# EasyEDA Pro project ProPrj_USB Hub Port PCB_2026-05-30.epro

# Schematic Schematic1
Board Name: Board1; Create Date: 2026-04-19; Page Name: P1; Project Name: USB Hub Port PCB; Schematic Name: Schematic1; Update Date: 2026-04-21; Company: EasyEDA.com; Page Size: A4; Version: V1.0
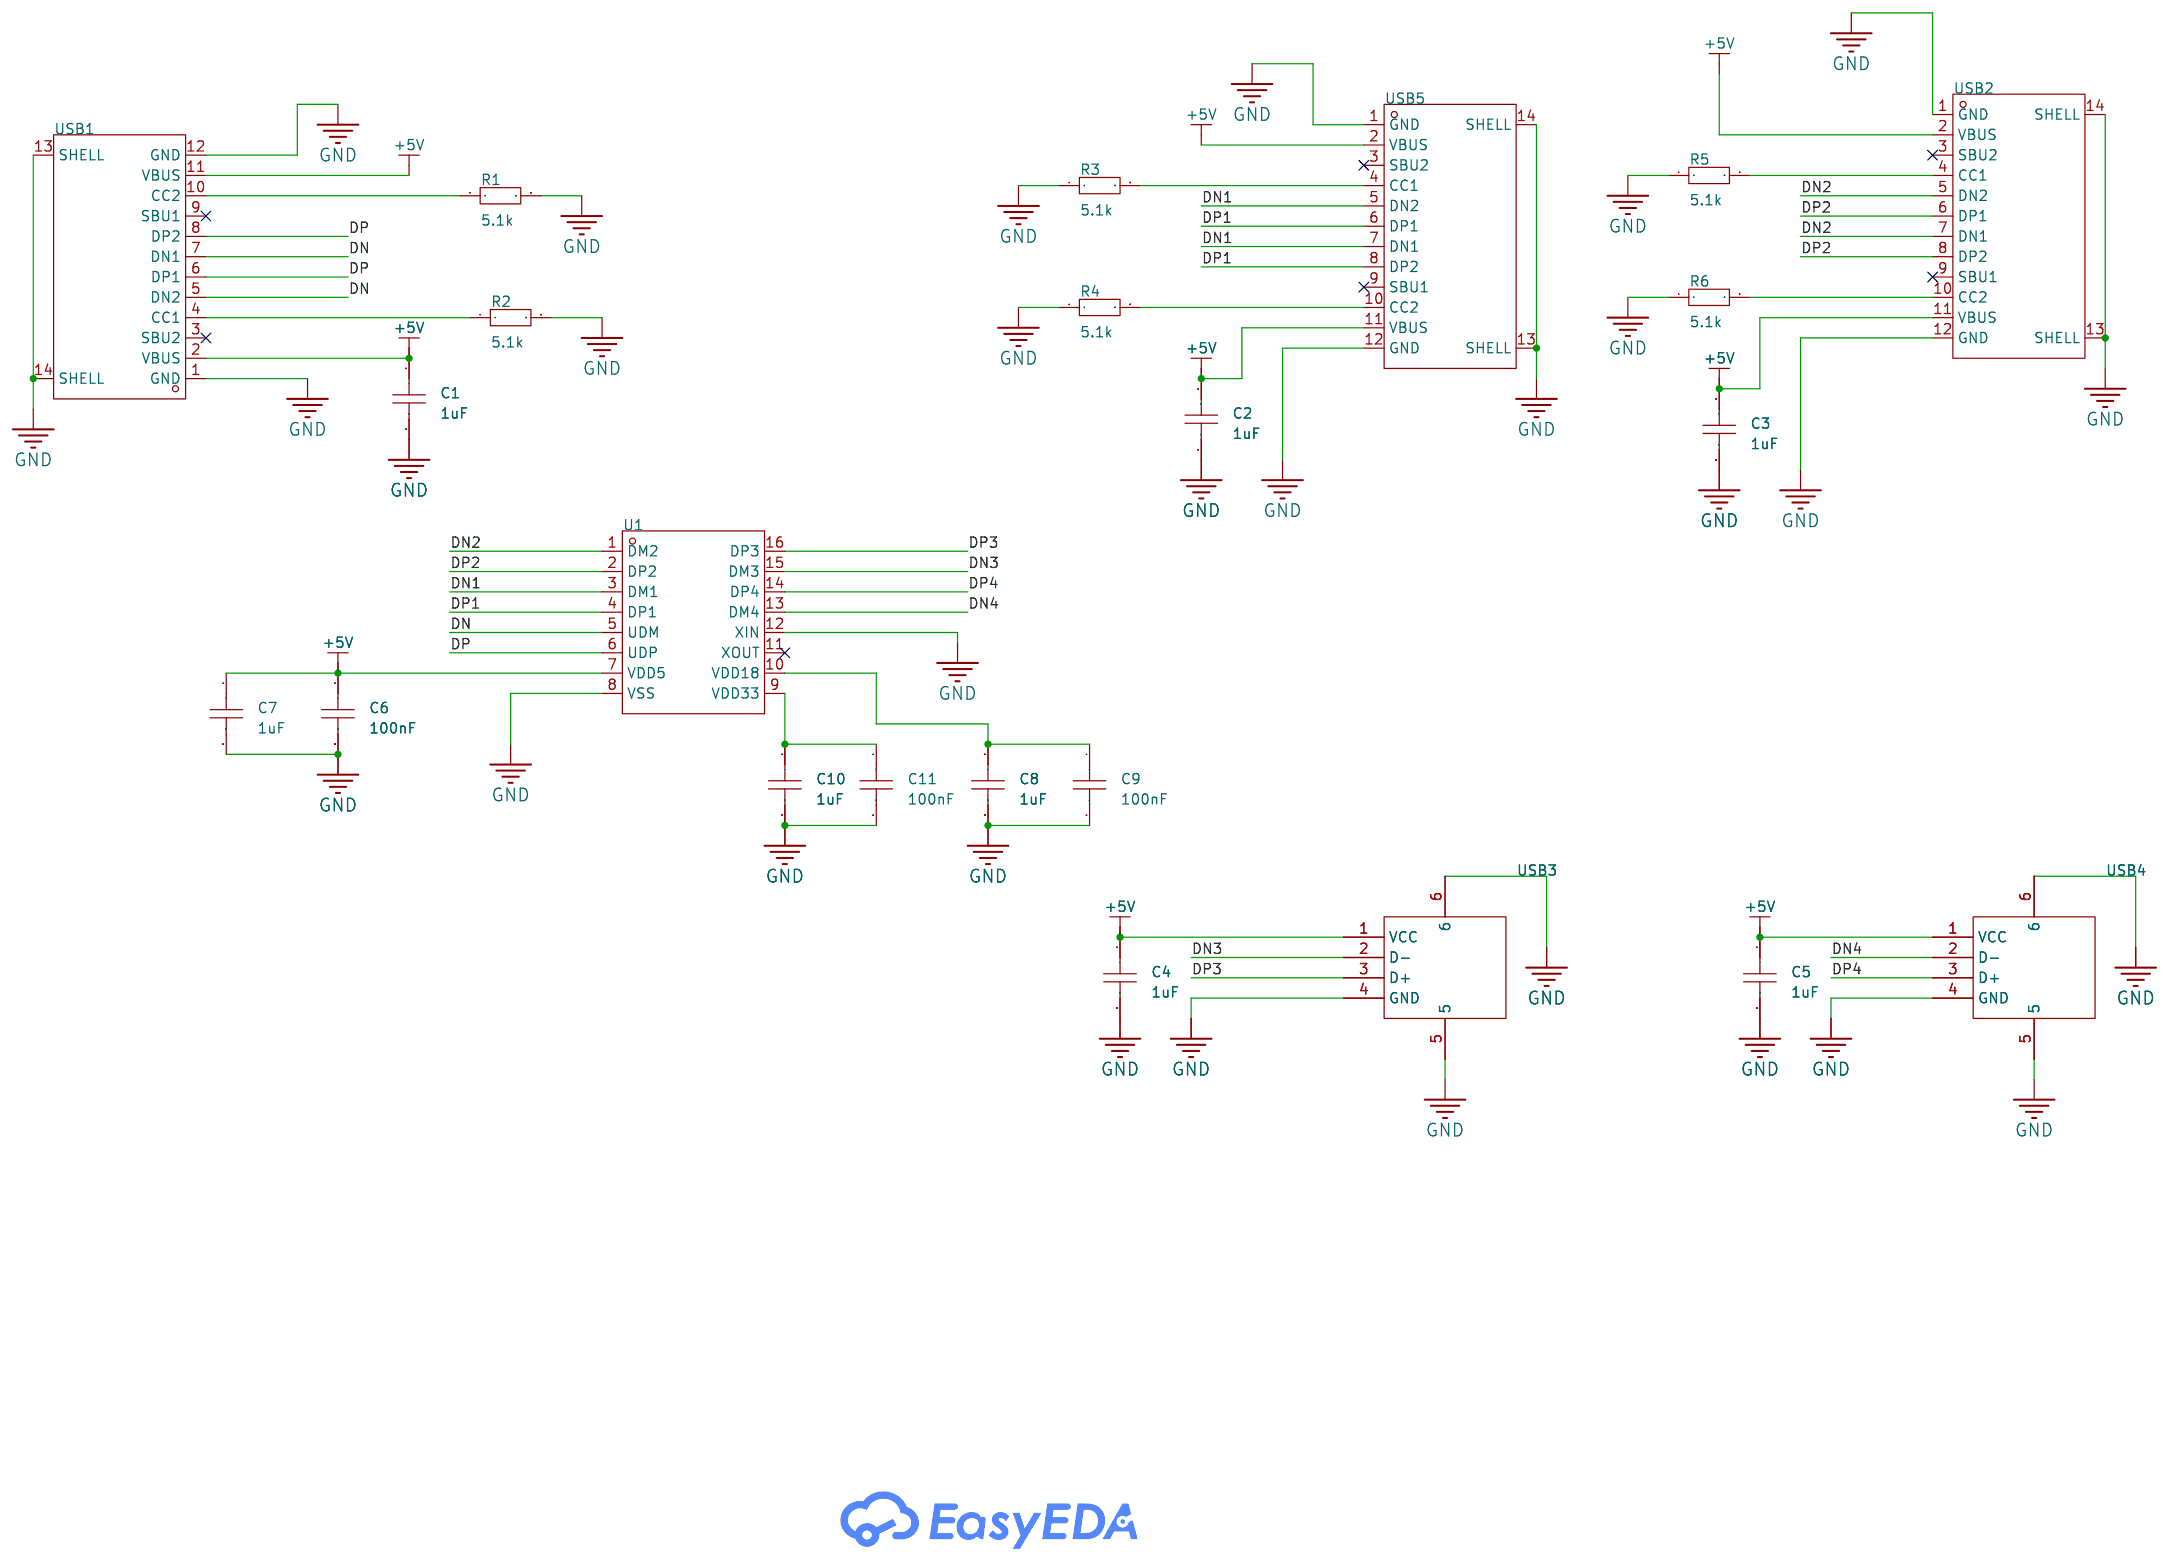
[diagram p0: schematic sheet]

## Parts
C1  1uF  [C0603]
C2  1uF  [C0603]
C3  1uF  [C0603]
C4  1uF  [C0603]
C5  1uF  [C0603]
C6  100nF  [C0603]
C7  1uF  [C0603]
C8  1uF  [C0603]
C9  100nF  [C0603]
C10  1uF  [C0603]
C11  100nF  [C0603]
R1  5.1k  [R0603]
R2  5.1k  [R0603]
R3  5.1k  [R0603]
R4  5.1k  [R0603]
R5  5.1k  [R0603]
R6  5.1k  [R0603]
U1  SL2.1s  [SSOP-16_L4.6-W2.6-P0.53-LS4.0-BL]
USB1  TYPE-C 16PIN 2MD(073)  [USB-C-SMD_TYPE-C-6PIN-2MD-073]
USB2  TYPE-C 16PIN 2MD(073)  [USB-C-SMD_TYPE-C-6PIN-2MD-073]
USB3  10.0 QHHTZB6.3  [USB-A-TH_10.0QHHTZB6.3]
USB4  10.0 QHHTZB6.3  [USB-A-TH_10.0QHHTZB6.3]
USB5  TYPE-C 16PIN 2MD(073)  [USB-C-SMD_TYPE-C-6PIN-2MD-073]

## Library data of the parts
C1-C11 = CAP_0603: Supplier Footprint: 0603
R1-R6 = Res_0603: Supplier Footprint: 0603
U1 = SL2.1s: type:Hub USB Protocol:USB 2.0 Data Rate:- Voltage - Supply:4V~5.25V Voltage - Supply:4V~5.25V Operating Temperature:0℃~+70℃ Operating Temperature:0℃~+70℃ Memory Interface:- Current - Supply:120mA Quiescent Supply Current:2.5mA Number of Channels:4; LCSC Part Name: USB2.0 HUB控制器集成电路; Supplier Part: C2684433; Manufacturer: CoreChips(和芯润德); Supplier Footprint: SSOP-16; JLCPCB Part Class: Extended Part; Datasheet: https://item.szlcsc.com/datasheet/SL2.1s/2782346.html; Supplier: LCSC; type: Hub; USB Protocol: USB 2.0; Voltage - Supply: 4V~5.25V; Operating Temperature: 0℃~+70℃; Current - Supply: 120mA; Quiescent Supply Current: 2.5mA; Number of Channels: 4
USB1 USB2 USB5 = TYPE-C 16PIN 2MD(073): Connector Type:Type-C Protocol Standard:- Gender:Female Mounting Type:Surface Mount, Right Angle Number of Contacts:16P Number of Ports:1 Current Rating-Power:3A Voltage Rating:5V Connect-Disconnect Life:10,000 Cycles Supplementary Features:- Center Heigh; LCSC Part Name: Type-C 母 卧贴; Supplier Part: C2765186; Manufacturer: SHOU HAN(首韩); Supplier Footprint: SMD; JLCPCB Part Class: Extended Part; Datasheet: https://item.szlcsc.com/datasheet/TYPE-C%252016PIN%25202MD(073)/2901843.html; Supplier: LCSC; Connector Type: Type-C; Gender: Female; Mounting Type: Surface Mount, Right Angle; Number of Contacts: 16P; Number of Ports: 1; Current Rating-Power: 3A; Voltage Rating: 5V; Connect-Disconnect Life: 10,000 Cycles; Detection color: Black; Operating Temperature: -25℃~+85℃
USB3 USB4 = 10.0 QHHTZB6.3: Connector Type:Type-A Protocol Standard:USB 2.0 Gender:Female Mounting Type:Surface Mount, Right Angle Number of Contacts:4P Number of Ports:1 Current Rating-Power:1.5A Voltage Rating:30V Connect-Disconnect Life:5,000 times Supplementary Features:- Center; LCSC Part Name: 壳长10.0mm; Supplier Part: C668591; Manufacturer: SHOU HAN(首韩); Supplier Footprint: SMD; JLCPCB Part Class: Extended Part; Datasheet: https://item.szlcsc.com/datasheet/10.0%2520QHHTZB6.3/698534.html; Supplier: LCSC; Connector Type: Type-A; Protocol Standard: USB 2.0; Gender: Female; Mounting Type: Surface Mount, Right Angle; Number of Contacts: 4P; Number of Ports: 1; Current Rating-Power: 1.5A; Voltage Rating: 30V; Connect-Disconnect Life: 5,000 times; Length: 10mm; Detection color: Black; Operating Temperature: -25℃~+85℃

## Nets
+5V: C1.1 C2.1 C3.1 C4.1 C5.1 C6.1 C7.1 U1.7(VDD5) USB1.2(VBUS) USB1.11(VBUS) USB2.2(VBUS) USB2.11(VBUS) USB3.1(VCC) USB4.1(VCC) USB5.2(VBUS) USB5.11(VBUS)
GND: C1.2 C2.2 C3.2 C4.2 C5.2 C6.2 C7.2 C8.2 C9.2 C10.2 C11.2 R1.2 R2.2 R3.1 R4.1 R5.1 R6.1 U1.8(VSS) U1.12(XIN) USB1.1(GND) USB1.12(GND) USB1.13(SHELL) USB1.14(SHELL) USB2.1(GND) USB2.12(GND) USB2.13(SHELL) USB2.14(SHELL) USB3.4(GND) USB3.5 USB3.6 USB4.4(GND) USB4.5 USB4.6 USB5.1(GND) USB5.12(GND) USB5.13(SHELL) USB5.14(SHELL)
DN: U1.5(UDM) USB1.5(DN2) USB1.7(DN1)
DN1: U1.3(DM1) USB5.5(DN2) USB5.7(DN1)
DN2: U1.1(DM2) USB2.5(DN2) USB2.7(DN1)
DN3: U1.15(DM3) USB3.2(D-)
DN4: U1.13(DM4) USB4.2(D-)
DP: U1.6(UDP) USB1.6(DP1) USB1.8(DP2)
DP1: U1.4(DP1) USB5.6(DP1) USB5.8(DP2)
DP2: U1.2(DP2) USB2.6(DP1) USB2.8(DP2)
DP3: U1.16(DP3) USB3.3(D+)
DP4: U1.14(DP4) USB4.3(D+)
$1N1031: R1.1 USB1.10(CC2)
$1N1035: R2.1 USB1.4(CC1)
$1N1639: R3.2 USB5.4(CC1)
$1N1643: R4.2 USB5.10(CC2)
$1N2417: R6.2 USB2.10(CC2)
$1N2458: R5.2 USB2.4(CC1)
$1N2907: C8.1 C9.1 U1.10(VDD18)
$1N3014: C10.1 C11.1 U1.9(VDD33)

Not connected (* = marked no-connect by the designer): U1 11(XOUT)*; USB1 3(SBU2)* 9(SBU1)*; USB2 3(SBU2)* 9(SBU1)*; USB5 3(SBU2)* 9(SBU1)*

# Board PCB1
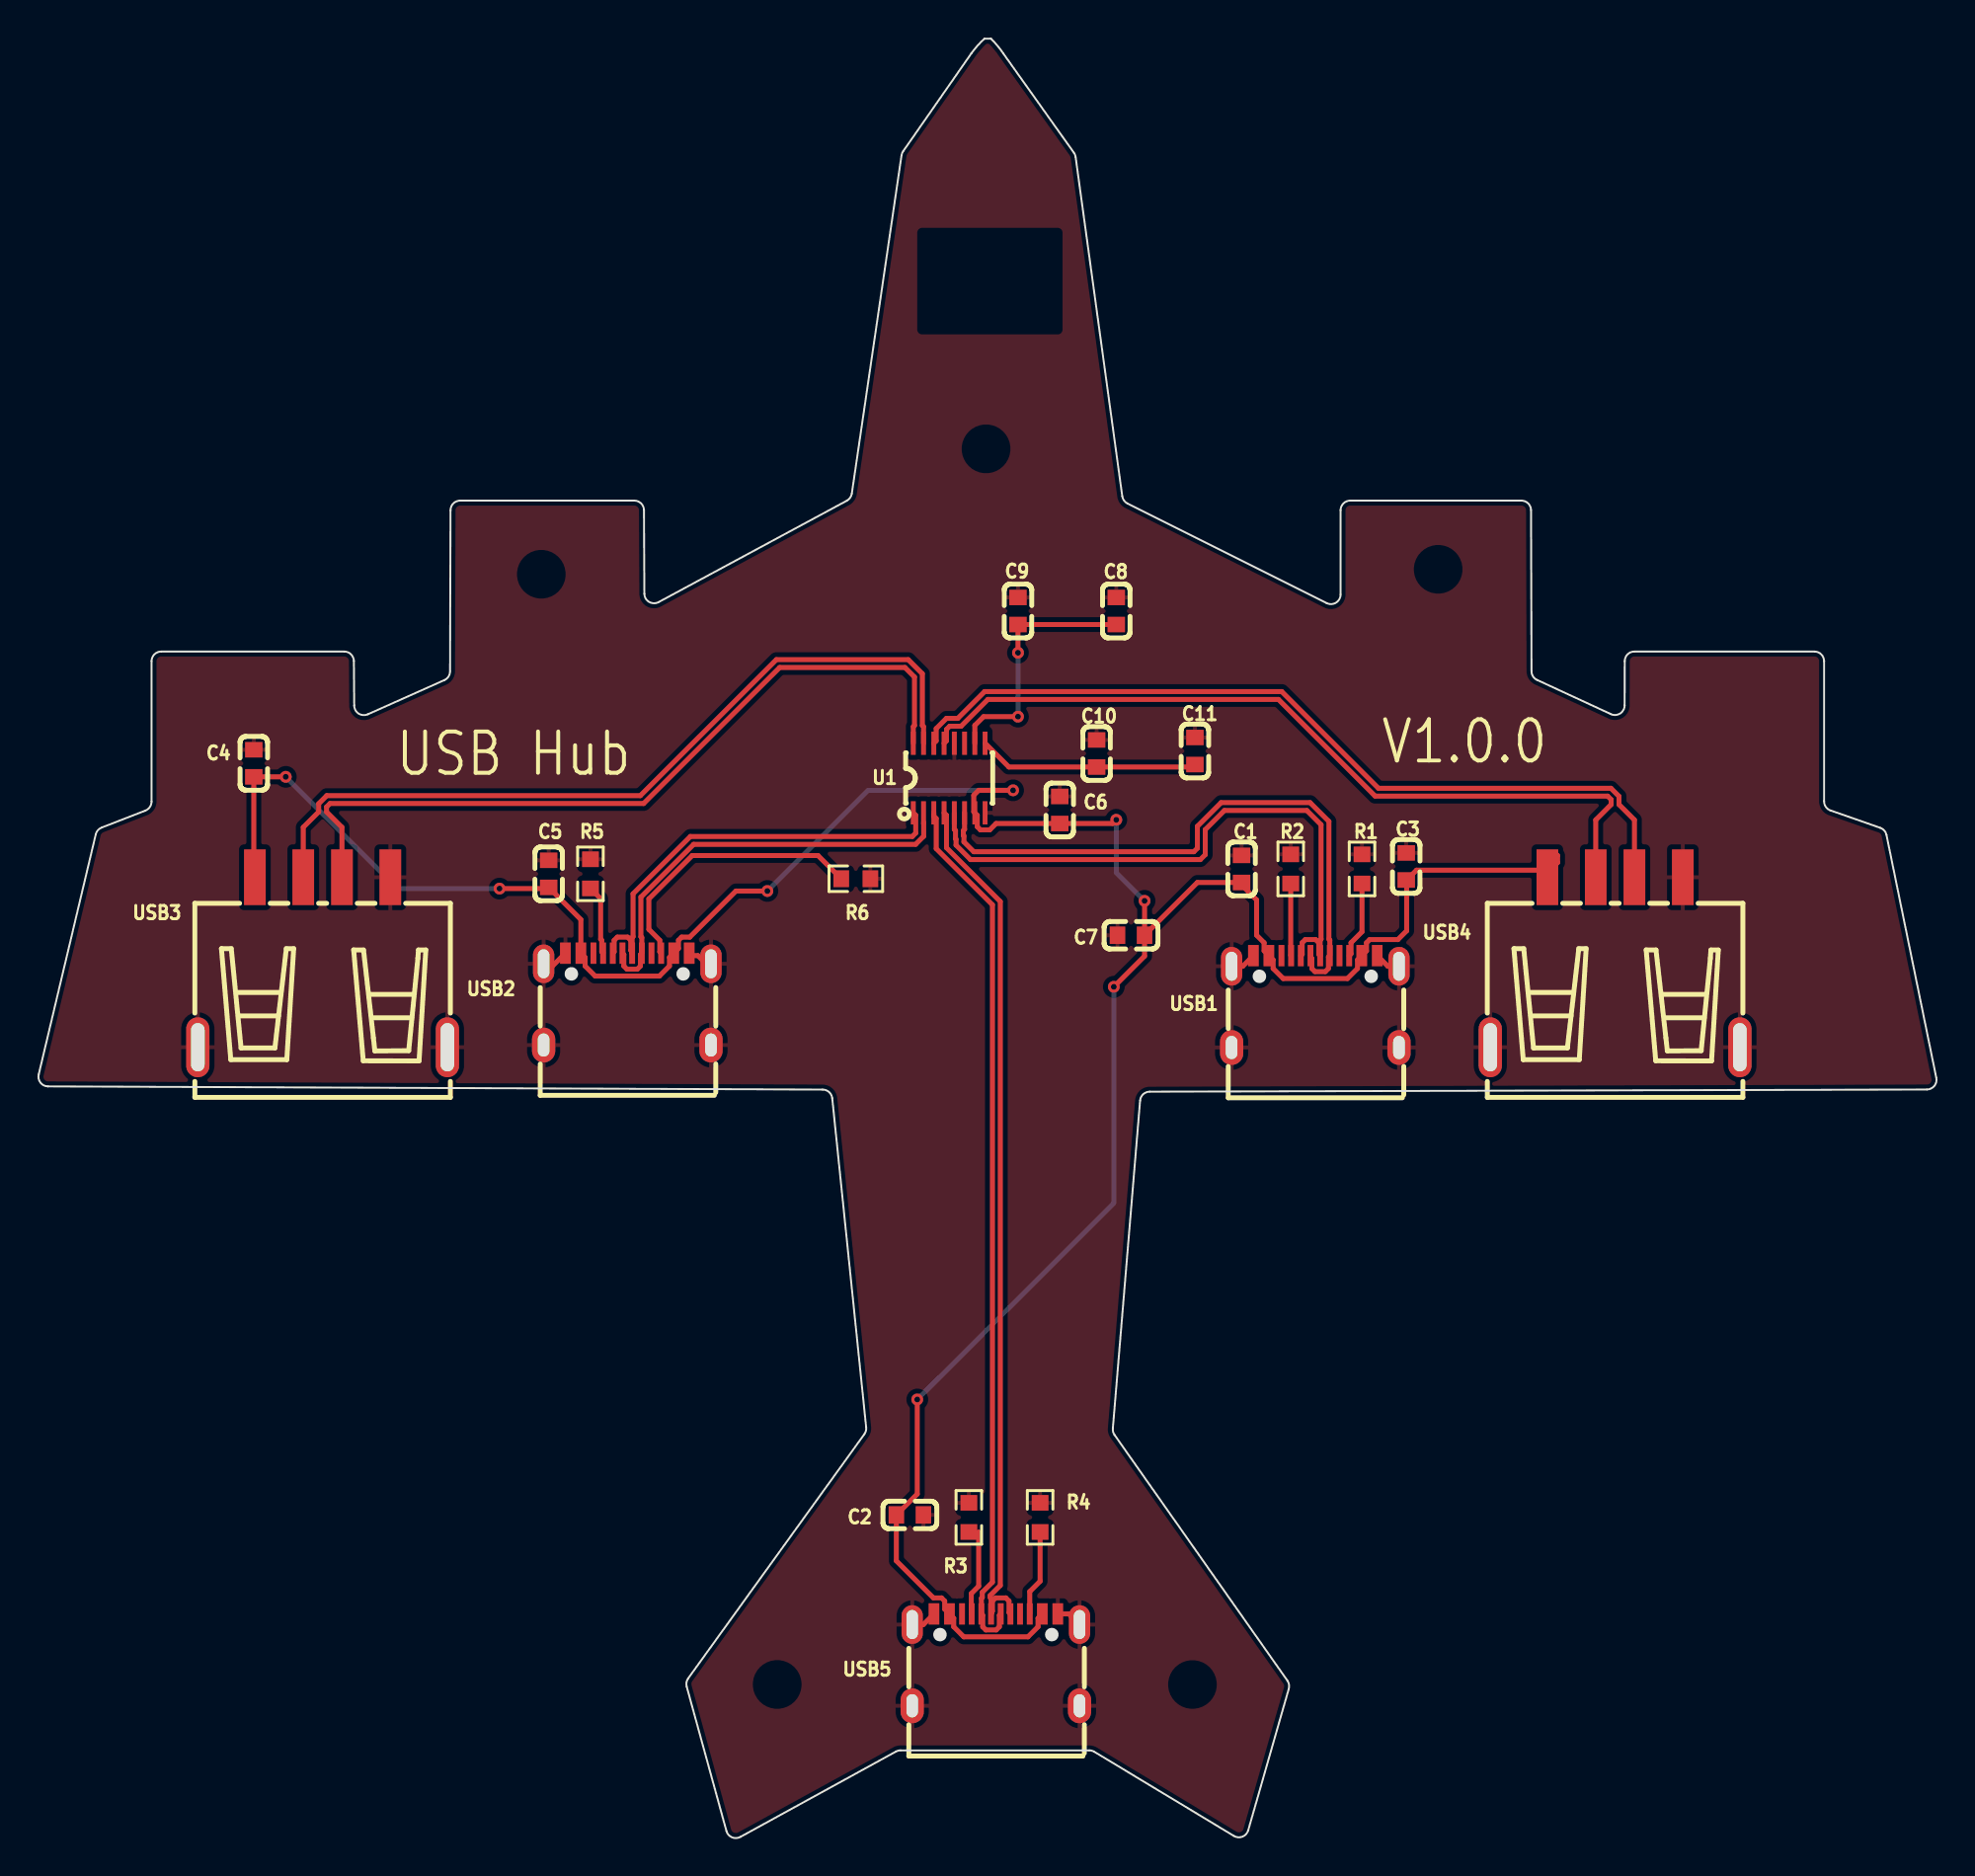
[diagram p1: board, top side]
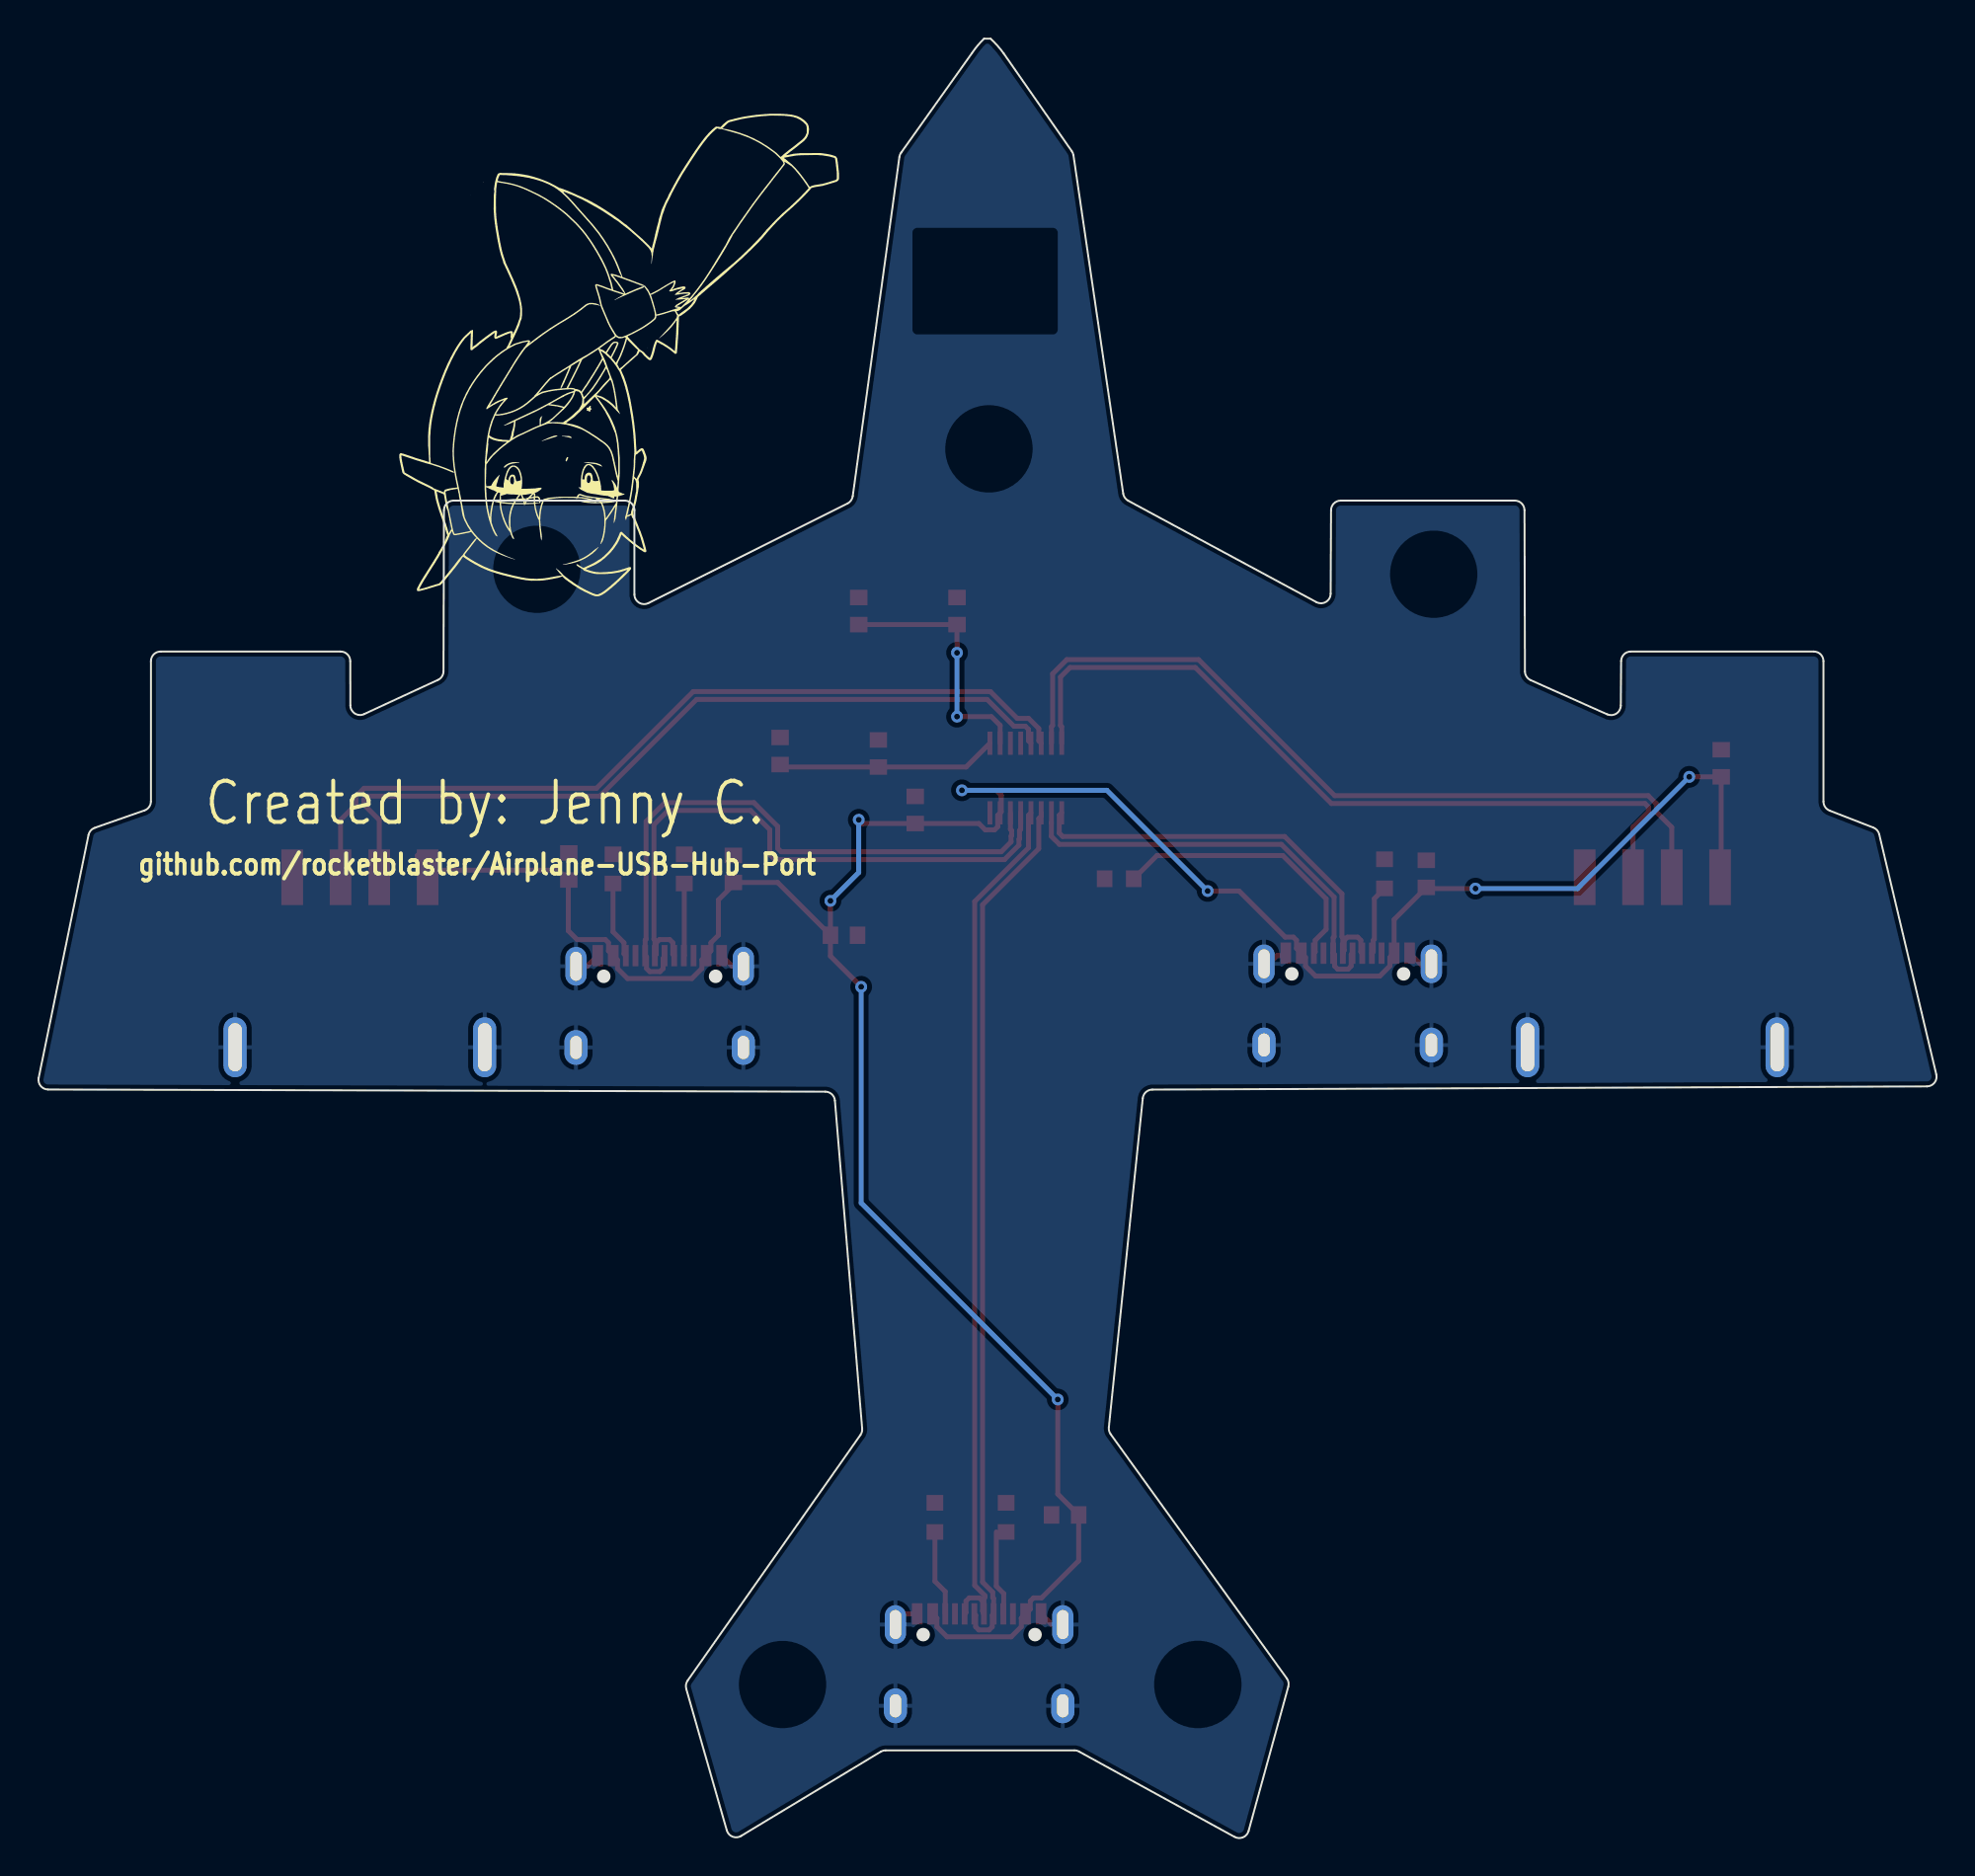
[diagram p2: board, bottom side, seen from below]

Outline 98.08 x 93 mm; copper layers: Top Layer, Bottom Layer. Coordinates in mm from the lower left corner of the outline.
Outline path: 0.48,38.83 arc(0.09,39.02) 0,39.44 2.95,51.86 arc(3.06,52.07) 3.25,52.21 5.51,53.09 arc(5.75,53.27) 5.83,53.55 5.83,60.81 arc(5.98,61.16) 6.33,61.31 15.79,61.31 arc(16.14,61.16) 16.29,60.81 16.31,58.52 arc(16.54,58.1) 17.01,58.06 20.97,59.83 arc(21.18,60.01) 21.26,60.29 21.28,68.61 arc(21.43,68.97) 21.78,69.11 30.78,69.11 arc(31.14,68.97) 31.28,68.62 31.3,64.3 arc(31.55,63.88) 32.04,63.87 41.77,69.11 arc(41.94,69.26) 42.03,69.48 44.6,86.96 arc(44.63,87.08) 44.69,87.19 48.2,92.23 arc(48.52,92.63) 48.88,93 49.22,93 arc(49.55,92.63) 49.85,92.23 53.5,87.11 arc(53.56,87) 53.59,86.88 56,69.34 arc(56.09,69.12) 56.28,68.96 66.56,63.81 arc(67.05,63.84) 67.29,64.26 67.29,68.61 arc(67.43,68.97) 67.79,69.11 76.63,69.11 arc(76.98,68.97) 77.13,68.61 77.16,60.29 arc(77.23,60.02) 77.45,59.84 81.26,58.07 arc(81.74,58.11) 81.97,58.53 81.97,60.81 arc(82.12,61.16) 82.47,61.31 91.78,61.31 arc(92.13,61.16) 92.28,60.81 92.28,53.56 arc(92.37,53.27) 92.61,53.09 95.18,52.2 arc(95.39,52.05) 95.5,51.82 98.08,39.27 arc(97.98,38.85) 97.59,38.66 57.42,38.55 arc(57.08,38.42) 56.93,38.09 55.52,21.13 arc(55.53,20.96) 55.61,20.8 64.54,8.1 arc(64.62,7.9) 64.61,7.68 62.51,0.36 arc(62.22,0.03) 61.77,0.07 54.56,4.42 arc(54.43,4.48) 54.3,4.5 44.55,4.5 arc(44.42,4.48) 44.3,4.43 36.27,0.02 arc(35.83,0) 35.54,0.33 33.49,7.79 arc(33.48,8.01) 33.57,8.22 42.68,20.85 arc(42.75,21.01) 42.77,21.19 41.01,38.21 arc(40.85,38.53) 40.52,38.66 0.48,38.83
Stack: Top Layer 0.035mm / Dielectric1 1.51mm FR4 er 4.5 / Bottom Layer 0.035mm

## Design rules (mm)
net DN2: DP5
net DP2: DP5
net DN1: DP1
net DP1: DP1
net DN: DP2
net DP: DP2
net DP4: DP4
net DP3: DP3
net DN3: DP3
net DN4: DP4
template: Custom Config
spacing copperThickness1oz (default): track to track 0.102, other pairs 0.152 to 0.3
spacing copperThickness2oz: track to track 0.203, other pairs 0.152 to 0.3
track width copperThickness1oz (default): min 0.127, default 0.254, max 2.54
track width copperThickness2oz: min 0.203, default 0.254, max 2.54
differential pair differentialPair (default): width min 0.127, default 0.254, max 2.54; gap min 0.152, default 0.152
via viaSize (default): diameter min 0.5, default 0.61, max 10; hole min 0.3, default 0.305, max 6.3

## Placement (name value [footprint] x y rotation side)
C1  1uF  [C0603]  62.17 50.07 90 top
C2  1uF  [C0603]  45.03 16.67 0 top
C3  1uF  [C0603]  70.68 50.2 90 top
C4  1uF  [C0603]  11.12 55.53 90 top
C5  1uF  [C0603]  26.36 49.82 90 top
C6  100nF  [C0603]  52.77 53.12 90 top
C7  1uF  [C0603]  56.46 46.64 180 top
C8  1uF  [C0603]  55.69 63.4 90 top
C9  100nF  [C0603]  50.61 63.4 90 top
C10  1uF  [C0603]  54.68 56.04 90 top
C11  100nF  [C0603]  59.76 56.17 90 top
R1  5.1k  [R0603]  68.39 50.07 90 top
R2  5.1k  [R0603]  64.71 50.07 90 top
R3  5.1k  [R0603]  48.07 16.54 270 top
R4  5.1k  [R0603]  51.76 16.54 270 top
R5  5.1k  [R0603]  28.52 49.82 270 top
R6  5.1k  [R0603]  42.23 49.56 180 top
U1  SL2.1s  [SSOP-16_L4.6-W2.6-P0.53-LS4.0-BL]  47.06 54.77 0 top
USB1  TYPE-C 16PIN 2MD(073)  [USB-C-SMD_TYPE-C-6PIN-2MD-073]  65.98 43.21 0 top
USB2  TYPE-C 16PIN 2MD(073)  [USB-C-SMD_TYPE-C-6PIN-2MD-073]  30.42 43.34 0 top
USB3  10.0 QHHTZB6.3  [USB-A-TH_10.0QHHTZB6.3]  14.67 45.24 0 top
USB4  10.0 QHHTZB6.3  [USB-A-TH_10.0QHHTZB6.3]  81.48 45.24 0 top
USB5  TYPE-C 16PIN 2MD(073)  [USB-C-SMD_TYPE-C-6PIN-2MD-073]  49.47 9.18 0 top

## Footprints (pads in the part's own frame, mm; a bottom-side part is the same pattern mirrored in y, then rotated)
C0603
  rect 0.8x0.9 smd: 1(-0.7,0) 2(0.7,0)
R0603
  rect 0.806x0.864 smd: 1(-0.753,0) 2(0.753,0)
SSOP-16_L4.6-W2.6-P0.53-LS4.0-BL
  rect 0.25x1.2 smd: 1(-1.855,-1.8) 2(-1.325,-1.8) 3(-0.795,-1.8) 4(-0.265,-1.8) 5(0.265,-1.8) 6(0.795,-1.8) 7(1.325,-1.8) 8(1.855,-1.8) 9(1.855,1.8) 10(1.325,1.8) 11(0.795,1.8) 12(0.265,1.8) 13(-0.265,1.8) 14(-0.795,1.8) 15(-1.325,1.8) 16(-1.855,1.8)
USB-A-TH_10.0QHHTZB6.3
  rect 1.12x2.88 smd: 1(-3.5,4.395) 2(-1,4.395) 3(1,4.395) 4(3.5,4.395)
  oval 1.2x3.1 hole 0.7x2.5: 5(-6.45,-4.395) 6(6.45,-4.395)
USB-C-SMD_TYPE-C-6PIN-2MD-073
  rect 0.55x1.1 smd: 1(-3.2,2.375) 2(-2.4,2.375) 11(2.4,2.375) 12(3.2,2.375)
  rect 0.3x1.1 smd: 3(-1.75,2.375) 4(-1.25,2.375) 5(-0.75,2.375) 6(-0.25,2.375) 7(0.25,2.375) 8(0.75,2.375) 9(1.25,2.375) 10(1.75,2.375)
  oval 1.1x2 hole 0.6x1.5: 13(-4.325,1.825) 14(4.325,1.825)
  oval 1.2x1.8 hole 0.6x1.2: 13(-4.325,-2.375) 14(4.325,-2.375)

## Nets
As in the schematic.

Pads without a net: U1 11; USB1 3 9; USB2 3 9; USB5 3 9

## Via types
v1: diameter 0.61, hole 0.305, Top Layer to Bottom Layer, 10 vias

## Routing (per net, layer and track width the routed paths; a pad name or vN(x,y) marks a point on that pad's centre or on a via; arc(x,y) is an arc through that point)
+5V: length 152.2
  Top Layer w0.254: 57.16,46.64 57.16,45.56 v1(55.57,43.97) ; 57.16,46.64 59.89,49.37 C1.1 62.17,49.24 62.95,48.47 62.95,46.64 63.34,46.25 63.34,45.83 USB1.2 63.8,45.37 63.8,44.92 64.32,44.4 67.64,44.4 68.16,44.92 68.16,45.37 USB1.11 68.63,45.83 68.63,46.25 68.79,46.42 70.25,46.42 70.7,46.87 70.7,49.5 71.21,50 78.11,50 78.51,50.4 78.51,50.76 78.36,50.91 77.98,50.91 ; 57.16,46.64 v1(57.16,48.42) ; v1(45.41,22.64) 45.41,17.75 44.33,16.67 44.33,14.3 46.24,12.38 46.66,12.38 46.83,12.22 46.83,11.8 USB5.2 47.29,11.33 47.29,10.89 47.81,10.37 51.13,10.37 51.65,10.89 51.65,11.33 USB5.11 ; USB3.1 11.12,49.69 C4.1 v1(12.77,54.83) ; v1(55.69,52.61) 55.5,52.42 C6.1 49.48,52.42 49.15,52.09 48.67,52.09 48.51,52.25 48.51,52.84 U1.7 48.33,53.02 48.33,53.88 48.58,54.13 v1(50.36,54.13) ; v1(23.82,49.05) 26.3,49.05 C5.1 28.02,47.45 USB2.2 28.24,45.49 28.24,45.05 28.76,44.53 32.08,44.53 32.6,45.05 32.6,45.49 USB2.11 33.07,45.96 33.07,46.38 33.23,46.54 33.65,46.54 36.03,48.93 v1(37.66,48.93)
  Bottom Layer w0.254: v1(57.16,48.42) 55.69,49.88 v1(55.69,52.61) ; v1(23.82,49.05) 18.55,49.05 v1(12.77,54.83) ; v1(50.36,54.13) 42.87,54.13 v1(37.66,48.93) ; v1(45.41,22.64) 55.57,32.8 v1(55.57,43.97)
GND: length 8.1
  Top Layer w0.254: USB5.12 53.25,11.55 53.8,11 ; 33.49,45.59 34.07,45.59 34.62,45.04 ; USB5.1 45.72,11 45.15,11 ; USB1.12 69.73,45.04 USB1.14 ; 25.97,45.04 26.54,45.04 27.09,45.59 ; USB1.1 62.23,45.04 USB1.13
DN: length 32.2
  Top Layer w0.254: U1.5 47.32,52.11 47.39,52.05 47.39,51.63 47.41,51.6 47.41,51.3 48.16,50.55 60.04,50.55 60.29,50.81 60.29,52.1 61.28,53.09 65.54,53.09 66.28,52.36 66.28,46.44 66.23,46.39 USB1.7 66.16,45.66 66.16,46.25 66,46.42 65.47,46.42 65.3,46.25 65.3,45.66 USB1.5
DN1: length 45.3
  Top Layer w0.254: USB5.7 49.65,11.48 49.65,10.89 49.49,10.72 48.96,10.72 48.79,10.89 48.79,11.48 USB5.5 48.72,12.35 48.77,12.4 48.77,12.67 49.29,13.19 49.29,48.21 46.39,51.12 46.39,52.67 46.26,52.8 U1.3
DN2: length 22.5
  Top Layer w0.254: U1.1 45.33,52.84 45.33,51.92 45.15,51.75 33.68,51.75 30.72,48.78 30.72,46.56 30.67,46.52 USB2.7 30.65,45.74 30.65,45.81 30.6,45.86 30.6,46.38 30.44,46.54 29.91,46.54 29.74,46.38 29.74,45.78 USB2.5
DN3: length 41.4
  Top Layer w0.254: 13.67,50.53 13.67,52.22 14.47,53.02 14.47,53.44 14.89,53.86 31.1,53.86 38.13,60.89 44.94,60.89 45.67,60.16 45.67,57.48 45.73,57.42 U1.15
DN4: length 41
  Top Layer w0.254: U1.13 46.92,56.69 46.92,57.28 47.08,57.45 47.67,57.45 49.06,58.83 64.08,58.83 69.08,53.83 81.09,53.83 81.27,53.65 81.27,53.4 80.48,52.6 80.48,50.91
DP: length 32.1
  Top Layer w0.254: U1.6 47.85,52.11 47.79,52.05 47.79,51.8 47.82,51.77 47.82,51.47 48.33,50.96 59.71,50.96 59.89,51.14 59.89,52.27 61.11,53.5 65.71,53.5 66.68,52.52 66.68,46.44 66.73,46.39 USB1.8 66.66,45.52 66.66,44.92 66.5,44.76 65.97,44.76 65.8,44.92 65.8,45.44 65.75,45.49 65.75,45.56 USB1.6
DP1: length 45.2
  Top Layer w0.254: U1.4 46.92,52.84 46.92,51.16 49.7,48.38 49.7,13.02 49.17,12.5 49.17,12.4 49.22,12.35 USB5.6 49.24,11.57 49.24,11.65 49.29,11.7 49.29,12.22 49.46,12.38 49.99,12.38 50.15,12.22 50.15,11.62 USB5.8
DP2: length 21.9
  Top Layer w0.254: USB2.6 30.24,45.64 30.24,45.05 30.41,44.88 30.94,44.88 31.1,45.05 31.1,45.64 USB2.8 31.17,46.52 31.12,46.56 31.12,48.61 33.85,51.34 45.32,51.34 45.74,51.76 45.74,52.48
DP3: length 40.1
  Top Layer w0.254: U1.16 45.2,57.42 45.27,57.48 45.27,59.99 44.77,60.48 38.3,60.48 31.26,53.45 15.06,53.45 14.88,53.27 14.88,53.02 15.67,52.22 15.67,50.53
DP4: length 42.4
  Top Layer w0.254: U1.14 46.39,56.69 46.39,57.33 46.91,57.85 47.5,57.85 48.89,59.24 64.24,59.24 69.24,54.24 81.26,54.24 81.68,53.82 81.68,53.4 82.48,52.6 82.48,50.91
$1N1031: length 4
  Top Layer w0.254: USB1.10 67.83,45.68 67.83,46.25 68.39,46.82 R1.1
$1N1035: length 3.7
  Top Layer w0.254: R2.1 64.71,45.61 USB1.4
$1N1639: length 4.4
  Top Layer w0.254: USB5.4 48.2,11.57 48.2,12.6 48.58,12.99 48.58,15.79
$1N1643: length 4.5
  Top Layer w0.254: USB5.10 51.22,12.7 51.76,13.24 R4.2
$1N2417: length 14.4
  Top Layer w0.254: R6.2 40.28,50.76 33.78,50.76 31.54,48.52 31.54,46.94 32.1,46.38 32.1,45.78 USB2.10
$1N2458: length 3.6
  Top Layer w0.254: R5.2 29.04,48.53 29.04,46.44 29.1,46.38 29.1,45.78 USB2.4
$1N2907: length 13.2
  Top Layer w0.254: v1(50.61,57.94) 48.84,57.94 48.38,57.49 U1.10 ; C8.1 C9.1 v1(50.61,61.25)
  Bottom Layer w0.254: v1(50.61,61.25) v1(50.61,57.94)
$1N3014: length 11.4
  Top Layer w0.254: U1.9 50.14,55.34 C10.1 59.63,55.34 C11.1

## Copper pours and planes (outline as drawn; the poured copper is in the pictures)
GND on Top Layer: -2.73,96.25 102.3,96.25 102.3,-4.03 -2.73,-4.03
GND on Bottom Layer: -2.73,98.96 102.81,98.96 102.81,-3.4 -2.73,-3.4

## Text on the board
Bottom Silkscreen Layer: github.com/rocketblaster/Airplane-USB-Hub-Port | Created by: Jenny C.
Top Silkscreen Layer: USB Hub | V1.0.0
